# Altium schematic sheet Power Supply.SchDoc
size Letter; SheetNumber: 1; SheetTotal: 15; SPICEModelCacheXQHQXUBJ: <root> / <DocumentId>XQHQXUBJ</DocumentId> / </root>
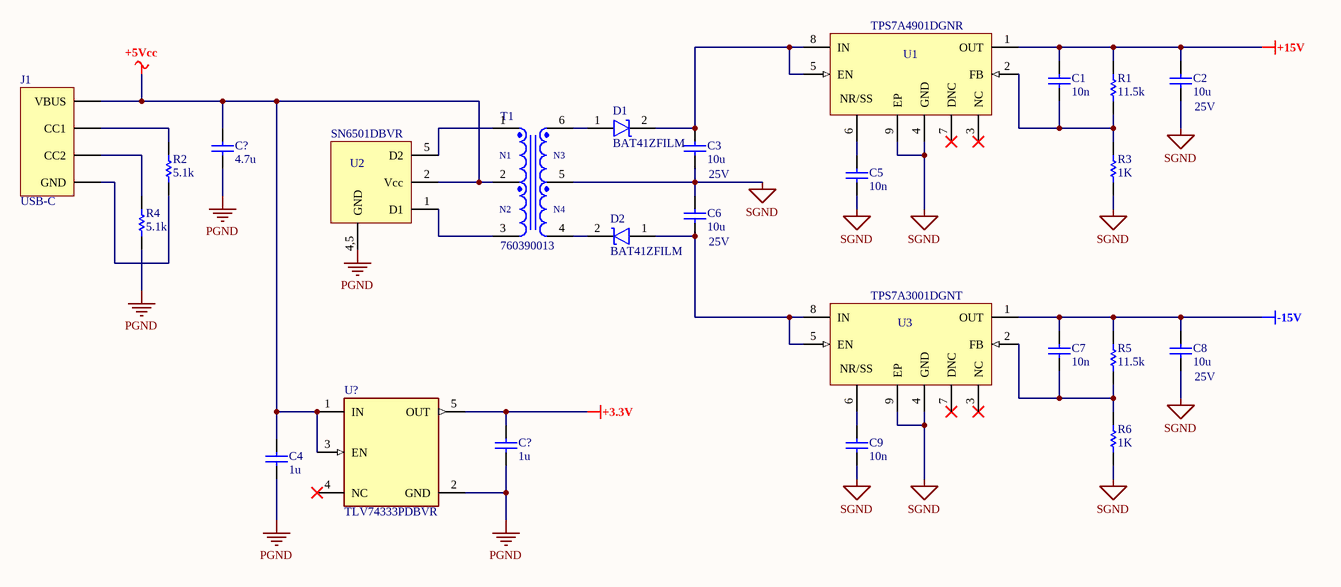
[diagram p0: Power Supply.SchDoc]

## Parts
(Parts that share a designator on the sheet are numbered #1, #2 ... from top to bottom, then left to right.)
C1  value 10n  (hidden comment: Capacitor)
C2  25V  value 10u
C3  25V  value 10u
C4  value 1u  (hidden comment: Capacitor)
C5  value 10n  (hidden comment: Capacitor)
C6  25V  value 10u
C7  value 10n  (hidden comment: Capacitor)
C8  25V  value 10u
C9  value 10n  (hidden comment: Capacitor)
C?#1  value 4.7u  (hidden comment: Capacitor)
C?#2  value 1u  (hidden comment: Capacitor)
D1  BAT41ZFILM
D2  BAT41ZFILM
J1  USB-C  [FP-USB4125-GF-A-0190-MFG]
R1  value 11.5k  (hidden comment: Resistor)
R2  value 5.1k  (hidden comment: Resistor)
R3  value 1K  (hidden comment: Resistor)
R4  value 5.1k  (hidden comment: Resistor)
R5  value 11.5k  (hidden comment: Resistor)
R6  value 1K  (hidden comment: Resistor)
T1  760390013  [WE-PPTI_1006_L10.2W6.73H4.19]
U1  TPS7A4901DGNR  [DGN0008D_M]
U2  SN6501DBVR
U3  TPS7A3001DGNT  [DGN0008D_M]
U?  TLV74333PDBVR  [FP-DBV0005A-MFG]

## Nets
+3.3V: C?#2.2 U?.5(OUT)
+5Vcc: C4.2 C?#1.2 J1.1(VBUS) T1.2 U2.2(Vcc) U?.1(IN) U?.3(EN)
+15V: C1.2 C2.2 R1.2 U1.1(OUT)
-15V: C7.2 C8.2 R5.2 U3.1(OUT)
PGND: C4.1 C?#1.1 C?#2.1 R4.1 U2.4,5(GND) U?.2(GND)
SGND: C2.1 C3.1 C5.1 C6.2 C8.1 C9.1 R3.1 R6.1 T1.5 U1.4(GND) U1.9(EP) U3.4(GND) U3.9(EP)
NetC1_1: C1.1 R1.1 R3.2 U1.2(FB)
NetC3_2: C3.2 D1.2(K) U1.5(EN) U1.8(IN)
NetC5_2: C5.2 U1.6(NR/SS)
NetC6_1: C6.1 D2.1(A) U3.5(EN) U3.8(IN)
NetC7_1: C7.1 R5.1 R6.2 U3.2(FB)
NetC9_2: C9.2 U3.6(NR/SS)
NetD1_1: D1.1(A) T1.6
NetD2_2: D2.2(K) T1.4
NetJ1_2: J1.2(CC1) R2.2
NetJ1_3: J1.3(CC2) R4.2
NetJ1_4: J1.4(GND) R2.1
NetT1_1: T1.1 U2.5(D2)
NetT1_3: T1.3 U2.1(D1)

Not connected (* = marked no-connect by the designer): U1 3(NC)* 7(DNC)*; U3 3(NC)* 7(DNC)*; U? 4(NC)*

## Notes on the sheet
- (in symbol WE-PPTI_1006) N1; N3; N2; N4

## Library data of the parts
C1-C9 C?#1 C?#2 = Capacitor: SimulationGenericComponent: True
D1 D2 = BAT41ZFILM: Rectifier Diode, Schottky, 1 Phase, 1 Element, 0.2A, 100V V(RRM), Silicon; Manufacturer: STMicroelectronics; Package Body Material: Plastic; Forward Voltage: 450mV; Non-rep Pk Forward Current-Max: 1A; Number of Elements: 1; Max Output current: 200mA; Time @ Peak Reflow Temperature-Max (s): 30s; Qualification Status: Not Qualified; Supplier: Mouser; Supplier Part Number: 511-BAT41ZFILM; Manufacturer Part Number: BAT41ZFILM; RoHS: Yes; Category: Rectifier Diodes; Stock: 43204; Pricing: 1=0.33, 10=0.232, 50=0.232, 100=0.117, 1000=0.071, 10000=0.049 (USD); Pins: 2; Diode Element Material: SILICON; Package Shape: Rectangular; Terminal Finish: Tin; Max Operating Temperature: 150°C; JESD-609 Code: e3; Diode Type: RECTIFIER; JESD-30 Code: R-PDSO-G2; Moisture Sensitivity Level: 1; Package Style: SMALL OUTLINEMeter; Peak Reflow Temperature (Cel): 260°C; Rep Pk Reverse Voltage-Max: 100V; Surface Mount: Yes; Technology: SCHOTTKY; Terminal Form: Gull Wing; Terminal Position: DUAL; Reach SVHC Compliant: Yes; RoHS Compliant: Yes; ComponentLink1URL: https://datasheet.ciiva.com:443/pdfs/VipMasterIC/IC/SGST/SGSTS35734/SGSTS35734-1.pdf?src-supplier=IHS+Markit; ComponentLink1Description: https://datasheet.ciiva.com:443/pdfs/VipMasterIC/IC/SGST/SGSTS35734/SGSTS35734-1.pdf?src-supplier=IHS+Markit; ComponentLink2URL: https://datasheet.ciiva.com/1242/cd00130227-1242625.pdf?src-supplier=Newark; ComponentLink2Description: https://datasheet.ciiva.com/1242/cd00130227-1242625.pdf?src-supplier=Newark; ComponentLink3URL: https://datasheet.ciiva.com/46385/1689714-46385901.pdf?src-supplier=Element14; ComponentLink3Description: https://datasheet.ciiva.com/46385/1689714-46385901.pdf?src-supplier=Element14; ComponentLink4URL: https://datasheet.ciiva.com/46385/1689714-46385899.pdf?src-supplier=Element14; ComponentLink4Description: https://datasheet.ciiva.com/46385/1689714-46385899.pdf?src-supplier=Element14; ComponentLink5URL: https://datasheet.ciiva.com/16421/cd00130227-16421670.pdf?src-supplier=Future+Electronics; ComponentLink5Description: https://datasheet.ciiva.com/16421/cd00130227-16421670.pdf?src-supplier=Future+Electronics; ComponentLink6URL: https://datasheet.ciiva.com/22733/1689714-22733175.pdf?src-supplier=Element14; ComponentLink6Description: https://datasheet.ciiva.com/22733/1689714-22733175.pdf?src-supplier=Element14; ComponentLink7URL: https://datasheet.ciiva.com/915/cd00130227-915684.pdf?src-supplier=Digikey; ComponentLink7Description: https://datasheet.ciiva.com/915/cd00130227-915684.pdf?src-supplier=Digikey; ComponentLink8URL: https://datasheet.ciiva.com/915/cd00130227-915683.pdf?src-supplier=Digikey; ComponentLink8Description: https://datasheet.ciiva.com/915/cd00130227-915683.pdf?src-supplier=Digikey; ComponentLink9URL: https://datasheet.ciiva.com/915/cd00130227-915685.pdf?src-supplier=Digikey; ComponentLink9Description: https://datasheet.ciiva.com/915/cd00130227-915685.pdf?src-supplier=Digikey; ComponentLink10URL: https://datasheet.ciiva.com/15192/getdatasheetpartid-141692-15192973.pdf?src-supplier=Verical; ComponentLink10Description: https://datasheet.ciiva.com/15192/getdatasheetpartid-141692-15192973.pdf?src-supplier=Verical
J1 = USB-C: Generic USB-C Connector, Female
R1-R6 = Resistor: TC1: 0; SimulationGenericComponent: True; TC2: 0
T1 = WE-PPTI_1006: TRANSFORMER 475UH SMD; NexarPartId: 26029731; Turns Ratio: 1:1.7; Current Rating: 150mA; Frequency: 10kHz; DC Resistance (DCR): 470mΩ; Inductance: 475µH; Isolation Voltage: 2.5kV; Termination: SMD/SMT; RoHS: Compliant; Mount: Surface Mount; Length: 10.05mm; Packaging: Digi-Reel®; Height: 4.19mm; Max DC Current: 150mA; Min Operating Temperature: -40°C; Case/Package: SMD/SMT; Max Operating Temperature: 125°C; Height - Seated (Max): 4.19mm; Width: 6.73mm
U1 = TPS7A4901DGNR: Adjustable Positive LDO Regulator, 1.176V Min, 33V Max, 0.6V Dropout, BIPolar, PDSO8; Manufacturer: Texas Instruments; Package Body Material: Plastic; Regulator Type: ADJUSTABLE POSITIVE SINGLE OUTPUT LDO REGULATOR; Dropout Voltage1-Max: 600mV; Dropout Voltage1-Nom: 333mV; Channels: 1; Output Current1-Max: 150mA; Output Voltage1-Min: 1.194V; Package Equivalence Code: TSSOP8,.19; Qualification Status: Not Qualified; Supplier: Mouser; Supplier Part Number: 595-TPS7A4901DGNR; Manufacturer Part Number: TPS7A4901DGNR; RoHS: Yes; Category: Voltage Regulators - Linear; Stock: 5747; Pricing: 1=2.84, 10=2.56, 50=2.56, 100=2.09, 1000=1.5, 10000=1.37 (USD); Case/Package: HTSSOP; Pins: 8; Terminal Finish: Nickel; Package Shape: Square; JESD-609 Code: e4; Moisture Sensitivity Level: 2; Adjustability: ADJUSTABLE; JESD-30 Code: S-PDSO-G8; Number of Outputs: 1; Operating Temperature, TJ-Max: 125°C; Operating Temperature, TJ-Min: -40°C; Output Voltage1-Max: 33V; Package Style: SMALL OUTLINE, HEAT SINK/SLUG, THIN PROFILE, SHRINK PITCHMeter; Packaging: Tape and Reel; Peak Reflow Temperature (Cel): 260°C; Surface Mount: Yes; Technology: BIPOLAR; Terminal Form: Gull Wing; Terminal Position: DUAL; Length: 3mm; Width: 3mm; Height - Seated (Max): 1.1mm; Terminal Pitch: 0.65mm; Reach SVHC Compliant: Yes; RoHS Compliant: Yes; ComponentLink1URL: https://www.ti.com:443/lit/ds/symlink/tps7a49.pdf?src-supplier=IHS+Markit; ComponentLink1Description: https://www.ti.com:443/lit/ds/symlink/tps7a49.pdf?src-supplier=IHS+Markit; ComponentLink2URL: https://datasheet.ciiva.com/4885/sbvs121b-126024-4885345.pdf?src-supplier=Mouser; ComponentLink2Description: https://datasheet.ciiva.com/4885/sbvs121b-126024-4885345.pdf?src-supplier=Mouser; ComponentLink3URL: https://datasheet.ciiva.com/41462/001015155-da-01-en-ic-reg-ldo-adj-tps7a4901dgnr-vssop-8-tid-41462999.pdf?src-supplier=Conrad; ComponentLink3Description: https://datasheet.ciiva.com/41462/001015155-da-01-en-ic-reg-ldo-adj-tps7a4901dgnr-vssop-8-tid-41462999.pdf?src-supplier=Conrad; ComponentLink4URL: https://datasheet.ciiva.com/7547/1857485-7547109.pdf?src-supplier=Newark; ComponentLink4Description: https://datasheet.ciiva.com/7547/1857485-7547109.pdf?src-supplier=Newark; ComponentLink5URL: https://datasheet.ciiva.com/14275/sbvs121b-14275869.pdf?src-supplier=Avnet; ComponentLink5Description: https://datasheet.ciiva.com/14275/sbvs121b-14275869.pdf?src-supplier=Avnet
U2 = SN6501DBVR: Interface Circuit, CMOS, PDSO5; Manufacturer: Texas Instruments; Package Body Material: Plastic; Channels: 1; Package Equivalence Code: TSOP5/6,.11,37; Power Supplies: 3.3/5V; Max Supply Voltage: 5.5V; Min Supply Voltage: 3V; Nominal Supply Voltage: 3.3V; Qualification Status: Not Qualified; Supplier: Mouser; Supplier Part Number: 595-SN6501DBVR; Manufacturer Part Number: SN6501DBVR; RoHS: Yes; Category: Power Management ICs; Stock: 54147; Pricing: 1=2.04, 10=1.8, 50=1.8, 100=1.47, 1000=1.01, 10000=0.88 (USD); Case/Package: LSSOP; Pins: 5; Terminal Finish: Nickel; Package Shape: Rectangular; Min Operating Temperature: -40°C; Max Operating Temperature: 125°C; JESD-609 Code: e4; JESD-30 Code: R-PDSO-G5; Moisture Sensitivity Level: 1; Package Style: SMALL OUTLINE, LOW PROFILE, SHRINK PITCHMeter; Surface Mount: Yes; Terminal Form: Gull Wing; Terminal Position: DUAL; Peak Reflow Temperature (Cel): 260°C; Interface IC Type: INTERFACE CIRCUIT; Technology: CMOS; Length: 2.9mm; Width: 1.6mm; Height - Seated (Max): 1.45mm; Terminal Pitch: 0.95mm; Reach SVHC Compliant: Yes; RoHS Compliant: Yes; Temperature Grade: AUTOMOTIVE; ComponentLink1URL: https://www.ti.com:443/lit/ds/symlink/sn6501.pdf?src-supplier=IHS+Markit; ComponentLink1Description: https://www.ti.com:443/lit/ds/symlink/sn6501.pdf?src-supplier=IHS+Markit; ComponentLink2URL: https://datasheet.ciiva.com/41798/sn6501-41798985.pdf?src-supplier=Digikey; ComponentLink2Description: https://datasheet.ciiva.com/41798/sn6501-41798985.pdf?src-supplier=Digikey
U3 = TPS7A3001DGNT: Adjustable Negative LDO Regulator, 1.18V Min, 33V Max, 0.6V Dropout, BIPolar, PDSO8; Manufacturer: Texas Instruments; Package Body Material: Plastic; Dropout Voltage1-Max: 600mV; Channels: 1; Output Current1-Max: 200mA; Regulator Type: ADJUSTABLE NEGATIVE SINGLE OUTPUT LDO REGULATOR; Dropout Voltage1-Nom: 325mV; Package Equivalence Code: TSSOP8,.19; Qualification Status: Not Qualified; Supplier: Mouser; Supplier Part Number: 595-TPS7A3001DGNT; Manufacturer Part Number: TPS7A3001DGNT; RoHS: Yes; Category: Voltage Regulators - Linear; Stock: 15878; Pricing: 1=4.76, 10=4.19, 50=4.19, 100=3.5, 250=3.32, 500=2.98, 1000=2.52, 2500=2.39, 10000=2.39 (USD); Case/Package: HTSSOP; Pins: 8; Package Shape: Square; Terminal Finish: Nickel; JESD-609 Code: e4; JESD-30 Code: S-PDSO-G8; Moisture Sensitivity Level: 2; Operating Temperature, TJ-Max: 125°C; Operating Temperature, TJ-Min: -40°C; Output Voltage1-Max: 33V; Output Voltage1-Min: 1.18V; Package Style: SMALL OUTLINE, HEAT SINK/SLUG, THIN PROFILE, SHRINK PITCHMeter; Surface Mount: Yes; Technology: BIPOLAR; Terminal Form: Gull Wing; Terminal Position: DUAL; Adjustability: ADJUSTABLE; Number of Outputs: 1; Packaging: Tape and Reel; Peak Reflow Temperature (Cel): 260°C; Length: 3mm; Width: 3mm; Height - Seated (Max): 1.1mm; Terminal Pitch: 0.65mm; Reach SVHC Compliant: Yes; RoHS Compliant: Yes; ComponentLink1URL: https://www.ti.com:443/lit/ds/symlink/tps7a30.pdf?src-supplier=IHS+Markit; ComponentLink1Description: https://www.ti.com:443/lit/ds/symlink/tps7a30.pdf?src-supplier=IHS+Markit; ComponentLink2URL: https://datasheet.ciiva.com/22733/1726442-22733400.pdf?src-supplier=Farnell; ComponentLink2Description: https://datasheet.ciiva.com/22733/1726442-22733400.pdf?src-supplier=Farnell; ComponentLink3URL: https://datasheet.ciiva.com/4885/sbvs125a-126025-4885255.pdf?src-supplier=Mouser; ComponentLink3Description: https://datasheet.ciiva.com/4885/sbvs125a-126025-4885255.pdf?src-supplier=Mouser; ComponentLink4URL: https://datasheet.ciiva.com/14276/tps7a3001-14276192.pdf?src-supplier=Avnet; ComponentLink4Description: https://datasheet.ciiva.com/14276/tps7a3001-14276192.pdf?src-supplier=Avnet
U? = CMP-04917-000051-1: IC REG LINEAR 3.3V 300MA SOT23-5; Manufacturer: Texas Instruments; Dropout Voltage: 125mV; Output Type: Fixed; Min Supply Voltage: 1.4V; Max Supply Voltage: 5.5V; Output Voltage: 1-3.3V; Standoff Height: 0mm; Nominal Supply Current: 34uA; Number Of Outputs: 1; Accuracy Percentage: 1%; Max Junction Temp: +125°C; Mouser Description: 300mA Low-Dropout (LDO) Regulator 5-SOT-23 -40 to 125; Device Class L1: Integrated Circuits (ICs); Temperature Range High: +125°C; Octopart: https://octopart.com/tlv74333pdbvr-texas+instruments-84791760; Device Class L3: Voltage Regulators - Linear; Height: 1.45mm; Category: IC; Temperature Range Low: -40°C; Output Current: 300mA; RoHS: TRUE; Automotive: No; Manufacturer Part Number: TLV74333PDBVR; Digikey Description: IC REG LINEAR 3.3V 300MA SOT23-5; Package: DBV0005A; Temperature: -40°C to +125°C; ComponentLink2URL: http://www.ti.com/lit/ds/symlink/tlv743p.pdf; Lead Free: Yes; Device Class L2: Power Management ICs; ComponentLink2Description: Datasheet